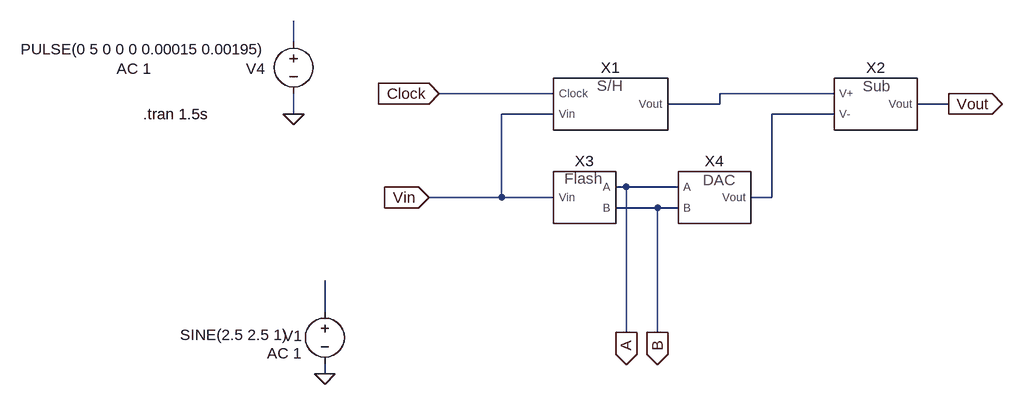
[diagram p0: schematic stage.asc]
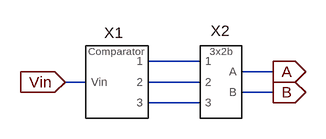
[diagram p1: sub-circuit flash2bits.asc]
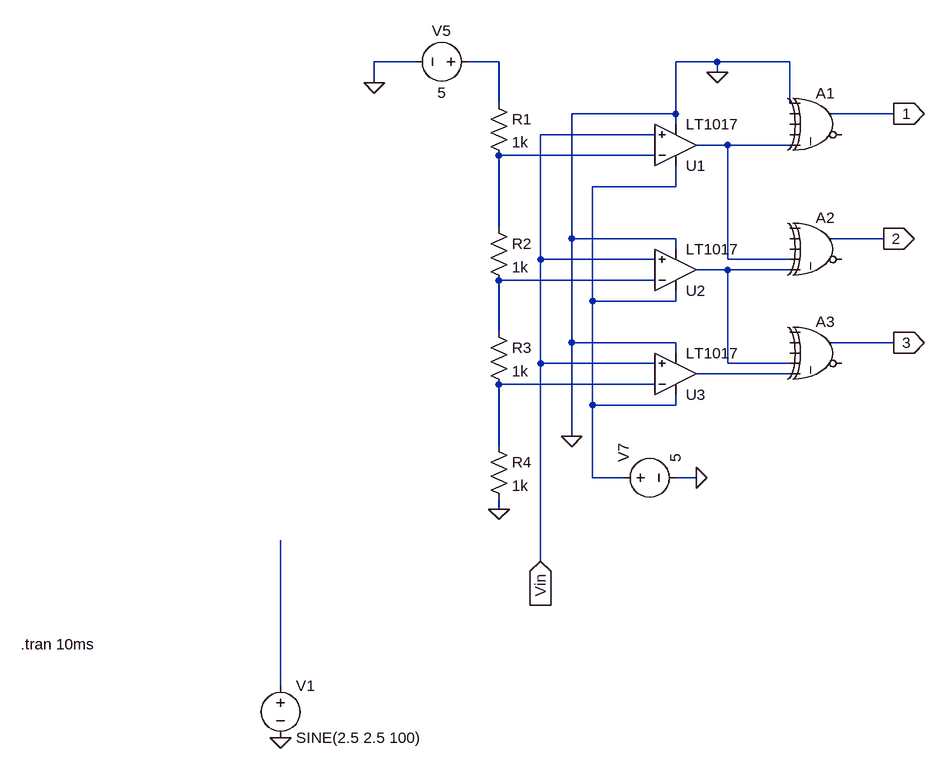
[diagram p2: sub-circuit 4bitscomparator.asc]
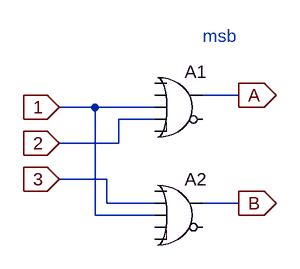
[diagram p3: sub-circuit 3dec2bits.asc]
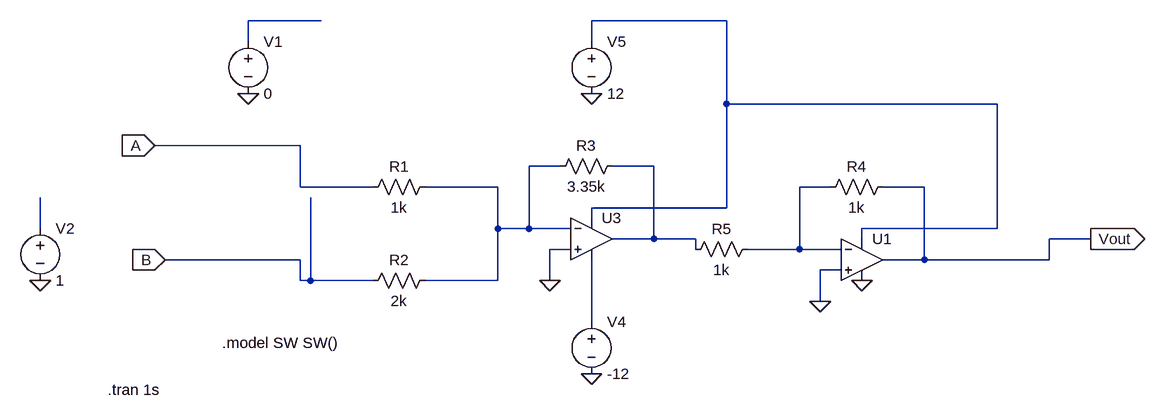
[diagram p4: sub-circuit dac.asc]
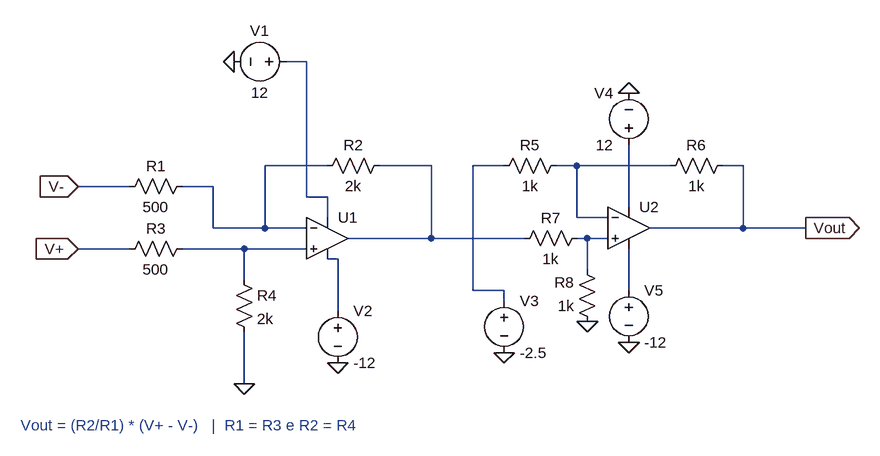
[diagram p5: sub-circuit subtractor.asc]
stage.asc, the LTspice schematic file:
Version 4
SHEET 1 1452 1236
WIRE -240 -80 -240 -112
WIRE 160 0 -16 0
WIRE 592 0 416 0
WIRE 416 16 416 0
WIRE 416 16 336 16
WIRE 768 16 720 16
WIRE -240 32 -240 0
WIRE 160 32 80 32
WIRE 592 32 496 32
WIRE 272 144 256 144
WIRE 352 144 272 144
WIRE 80 160 80 32
WIRE 80 160 -32 160
WIRE 160 160 80 160
WIRE 496 160 496 32
WIRE 496 160 464 160
WIRE 320 176 256 176
WIRE 352 176 320 176
WIRE -192 336 -192 288
WIRE 272 368 272 144
WIRE 320 368 320 176
WIRE -192 432 -192 416
FLAG -240 32 0
FLAG -192 432 0
FLAG 768 16 Vout
IOPIN 768 16 Out
FLAG 272 368 A
IOPIN 272 368 Out
FLAG 320 368 B
IOPIN 320 368 Out
FLAG -16 0 Clock
IOPIN -16 0 In
FLAG -32 160 Vin
IOPIN -32 160 In
SYMBOL voltage -192 320 R0
WINDOW 123 -89 80 Left 2
WINDOW 39 0 0 Left 0
WINDOW 0 -64 53 Left 2
WINDOW 3 -223 52 Left 2
SYMATTR Value2 AC 1
SYMATTR InstName V1
SYMATTR Value SINE(2.5 2.5 1)
SYMBOL voltage -240 -96 R0
WINDOW 123 -219 58 Right 2
WINDOW 39 0 0 Left 0
WINDOW 0 -44 58 Right 2
WINDOW 3 -42 28 Right 2
SYMATTR Value2 AC 1
SYMATTR InstName V4
SYMATTR Value PULSE(0 5 0 0 0 0.00015 0.00195)
SYMBOL SH 240 16 R0
SYMATTR InstName X1
SYMBOL flash2bits 208 160 R0
SYMATTR InstName X3
SYMBOL DAC 400 160 R0
SYMATTR InstName X4
SYMBOL subtractor 656 16 R0
SYMATTR InstName X2
TEXT -472 32 Left 2 !.tran 1.5s

flash2bits.asc, the sub-circuit schematic file:
Version 4
SHEET 1 880 680
WIRE 256 128 176 128
WIRE 368 144 320 144
WIRE 80 160 48 160
WIRE 256 160 176 160
WIRE 368 176 320 176
WIRE 256 192 176 192
FLAG 368 144 A
IOPIN 368 144 Out
FLAG 368 176 B
IOPIN 368 176 Out
FLAG 48 160 Vin
IOPIN 48 160 In
SYMBOL 4bitsComparator 128 160 R0
WINDOW 0 -5 -60 Bottom 2
SYMATTR InstName X1
SYMBOL 3dec2bits 288 160 R0
WINDOW 0 -1 -63 Bottom 2
SYMATTR InstName X2

4bitscomparator.asc, the sub-circuit schematic file:
Version 4
SHEET 1 2344 1640
WIRE 848 256 784 256
WIRE 976 256 928 256
WIRE 1312 256 1248 256
WIRE 1424 256 1312 256
WIRE 1312 272 1312 256
WIRE 784 288 784 256
WIRE 976 320 976 256
WIRE 1424 320 1424 256
WIRE 1248 336 1248 256
WIRE 1248 336 1088 336
WIRE 1584 336 1488 336
WIRE 1248 352 1248 336
WIRE 1216 368 1040 368
WIRE 1328 384 1280 384
WIRE 1424 384 1328 384
WIRE 1216 400 976 400
WIRE 1248 448 1248 416
WIRE 1248 448 1120 448
WIRE 976 512 976 400
WIRE 1088 528 1088 336
WIRE 1248 528 1088 528
WIRE 1568 528 1488 528
WIRE 1248 544 1248 528
WIRE 1040 560 1040 368
WIRE 1216 560 1040 560
WIRE 1328 560 1328 384
WIRE 1424 560 1328 560
WIRE 1328 576 1280 576
WIRE 1424 576 1328 576
WIRE 1216 592 976 592
WIRE 1120 624 1120 448
WIRE 1248 624 1248 608
WIRE 1248 624 1120 624
WIRE 976 672 976 592
WIRE 1088 688 1088 528
WIRE 1248 688 1088 688
WIRE 1584 688 1488 688
WIRE 1248 704 1248 688
WIRE 1040 720 1040 560
WIRE 1216 720 1040 720
WIRE 1328 720 1328 576
WIRE 1424 720 1328 720
WIRE 1424 736 1280 736
WIRE 1216 752 976 752
WIRE 1120 784 1120 624
WIRE 1248 784 1248 768
WIRE 1248 784 1120 784
WIRE 1088 832 1088 688
WIRE 976 848 976 752
WIRE 1120 896 1120 784
WIRE 1168 896 1120 896
WIRE 1280 896 1248 896
WIRE 976 944 976 928
WIRE 1040 1024 1040 720
WIRE 640 1216 640 992
FLAG 1312 272 0
FLAG 1280 896 0
FLAG 1584 688 3
IOPIN 1584 688 Out
FLAG 1568 528 2
IOPIN 1568 528 Out
FLAG 1584 336 1
IOPIN 1584 336 Out
FLAG 784 288 0
FLAG 976 944 0
FLAG 1040 1024 Vin
IOPIN 1040 1024 In
FLAG 640 1296 0
FLAG 1088 832 0
SYMBOL res 960 304 R0
SYMATTR InstName R1
SYMATTR Value 1k
SYMBOL voltage 944 256 R90
WINDOW 0 -32 56 VBottom 2
WINDOW 3 32 56 VTop 2
WINDOW 123 0 0 Left 0
WINDOW 39 0 0 Left 0
SYMATTR InstName V5
SYMATTR Value 5
SYMBOL res 960 496 R0
SYMATTR InstName R2
SYMATTR Value 1k
SYMBOL res 960 656 R0
SYMATTR InstName R3
SYMATTR Value 1k
SYMBOL voltage 1152 896 R270
WINDOW 123 0 0 Left 0
WINDOW 39 0 0 Left 0
SYMATTR InstName V7
SYMATTR Value 5
SYMBOL res 960 832 R0
SYMATTR InstName R4
SYMATTR Value 1k
SYMBOL Digital\\xor 1472 288 R0
SYMATTR InstName A1
SYMBOL Digital\\xor 1472 480 R0
SYMATTR InstName A2
SYMBOL Digital\\xor 1472 640 R0
SYMATTR InstName A3
SYMBOL voltage 640 1200 R0
WINDOW 123 0 0 Left 0
WINDOW 39 0 0 Left 0
SYMATTR InstName V1
SYMATTR Value SINE(2.5 2.5 100)
SYMBOL Comparators\\LT1017 1248 384 M180
SYMATTR InstName U1
SYMBOL Comparators\\LT1017 1248 576 M180
SYMATTR InstName U2
SYMBOL Comparators\\LT1017 1248 736 M180
SYMATTR InstName U3
TEXT 240 1152 Left 2 !.tran 10ms

3dec2bits.asc, the sub-circuit schematic file:
Version 4
SHEET 1 880 680
WIRE 352 32 304 32
WIRE 160 48 112 48
WIRE 240 48 160 48
WIRE 240 64 192 64
WIRE 192 96 192 64
WIRE 192 96 112 96
WIRE 176 144 112 144
WIRE 176 176 176 144
WIRE 240 176 176 176
WIRE 352 176 304 176
WIRE 160 192 160 48
WIRE 240 192 160 192
FLAG 352 32 A
IOPIN 352 32 Out
FLAG 352 176 B
IOPIN 352 176 Out
FLAG 112 48 1
IOPIN 112 48 In
FLAG 112 96 2
IOPIN 112 96 In
FLAG 112 144 3
IOPIN 112 144 In
SYMBOL Digital\\or 272 -16 R0
SYMATTR InstName A1
SYMBOL Digital\\or 272 128 R0
SYMATTR InstName A2
TEXT 304 -48 Left 2 ;msb

dac.asc, the sub-circuit schematic file:
Version 4
SHEET 1 1184 680
WIRE -112 -160 -224 -160
WIRE 512 -160 304 -160
WIRE -224 -128 -224 -160
WIRE 304 -128 304 -160
WIRE 512 -32 512 -160
WIRE 928 -32 512 -32
WIRE -144 32 -368 32
WIRE 256 64 208 64
WIRE 400 64 336 64
WIRE -144 96 -144 32
WIRE -32 96 -144 96
WIRE 160 96 48 96
WIRE 672 96 624 96
WIRE 816 96 752 96
WIRE 512 128 512 -32
WIRE 512 128 304 128
WIRE 304 144 304 128
WIRE -544 160 -544 112
WIRE 160 160 160 96
WIRE 208 160 208 64
WIRE 208 160 160 160
WIRE 272 160 208 160
WIRE 928 160 928 -32
WIRE 928 160 720 160
WIRE 400 176 400 64
WIRE 400 176 336 176
WIRE 464 176 400 176
WIRE 720 176 720 160
WIRE 1072 176 1008 176
WIRE 272 192 240 192
WIRE 464 192 464 176
WIRE 624 192 624 96
WIRE 624 192 544 192
WIRE 688 192 624 192
WIRE -144 208 -352 208
WIRE 816 208 816 96
WIRE 816 208 752 208
WIRE 1008 208 1008 176
WIRE 1008 208 816 208
WIRE 688 224 656 224
WIRE -144 240 -144 208
WIRE -128 240 -128 112
WIRE -128 240 -144 240
WIRE -32 240 -128 240
WIRE 160 240 160 160
WIRE 160 240 48 240
WIRE 240 240 240 192
WIRE 656 272 656 224
WIRE 304 304 304 208
FLAG 240 240 0
FLAG 1072 176 Vout
IOPIN 1072 176 Out
FLAG -368 32 A
IOPIN -368 32 In
FLAG -352 208 B
IOPIN -352 208 In
FLAG 304 -48 0
FLAG 656 272 0
FLAG 720 240 0
FLAG 304 384 0
FLAG -224 -48 0
FLAG -544 240 0
SYMBOL res 64 80 R90
WINDOW 0 0 56 VBottom 2
WINDOW 3 32 56 VTop 2
SYMATTR InstName R1
SYMATTR Value 1k
SYMBOL res 64 224 R90
WINDOW 0 0 56 VBottom 2
WINDOW 3 32 56 VTop 2
SYMATTR InstName R2
SYMATTR Value 2k
SYMBOL res 352 48 R90
WINDOW 0 0 56 VBottom 2
WINDOW 3 32 56 VTop 2
SYMATTR InstName R3
SYMATTR Value 3.35k
SYMBOL voltage 304 -144 R0
WINDOW 123 0 0 Left 0
WINDOW 39 0 0 Left 0
SYMATTR InstName V5
SYMATTR Value 12
SYMBOL Opamps\\UniversalOpamp2 304 176 R0
SYMATTR InstName U3
SYMBOL res 768 80 R90
WINDOW 0 0 56 VBottom 2
WINDOW 3 32 56 VTop 2
SYMATTR InstName R4
SYMATTR Value 1k
SYMBOL Opamps\\UniversalOpamp2 720 208 R0
SYMATTR InstName U1
SYMBOL res 560 176 R90
WINDOW 0 0 56 VBottom 2
WINDOW 3 32 56 VTop 2
SYMATTR InstName R5
SYMATTR Value 1k
SYMBOL voltage 304 288 R0
WINDOW 123 0 0 Left 0
WINDOW 39 0 0 Left 0
SYMATTR InstName V4
SYMATTR Value -12
SYMBOL voltage -224 -144 R0
WINDOW 123 0 0 Left 0
WINDOW 39 0 0 Left 0
SYMATTR InstName V1
SYMATTR Value 0
SYMBOL voltage -544 144 R0
WINDOW 123 0 0 Left 0
WINDOW 39 0 0 Left 0
SYMATTR InstName V2
SYMATTR Value 1
TEXT -264 336 Left 2 !.model SW SW()
TEXT -440 408 Left 2 !.tran 1s

subtractor.asc, the sub-circuit schematic file:
Version 4
SHEET 1 1344 680
WIRE 144 -128 112 -128
WIRE 176 32 80 32
WIRE 336 32 256 32
WIRE 448 32 400 32
WIRE 560 32 528 32
WIRE 704 32 560 32
WIRE 816 32 784 32
WIRE -128 64 -208 64
WIRE 0 64 -48 64
WIRE 144 80 144 -128
WIRE 176 80 144 80
WIRE 640 96 640 0
WIRE 176 112 176 80
WIRE 560 112 560 32
WIRE 608 112 560 112
WIRE 0 128 0 64
WIRE 80 128 80 32
WIRE 80 128 0 128
WIRE 144 128 80 128
WIRE 816 128 816 32
WIRE 816 128 672 128
WIRE 912 128 816 128
WIRE 336 144 336 32
WIRE 336 144 208 144
WIRE 480 144 336 144
WIRE 576 144 560 144
WIRE 608 144 576 144
WIRE -128 160 -208 160
WIRE 48 160 -48 160
WIRE 144 160 48 160
WIRE 192 176 176 176
WIRE 576 192 576 144
WIRE 48 208 48 160
WIRE 400 224 400 32
WIRE 448 224 400 224
WIRE 640 224 640 160
WIRE 448 240 448 224
WIRE 192 256 192 176
WIRE 48 368 48 288
FLAG 912 128 Vout
IOPIN 912 128 Out
FLAG -208 64 V-
IOPIN -208 64 In
FLAG -208 160 V+
IOPIN -208 160 In
FLAG 48 368 0
FLAG 32 -128 0
FLAG 192 336 0
FLAG 640 304 0
FLAG 640 -80 0
FLAG 448 320 0
FLAG 576 272 0
SYMBOL res 32 192 R0
SYMATTR InstName R4
SYMATTR Value 2k
SYMBOL res -32 144 R90
WINDOW 0 0 56 VBottom 2
WINDOW 3 32 56 VTop 2
SYMATTR InstName R3
SYMATTR Value 500
SYMBOL res -32 48 R90
WINDOW 0 0 56 VBottom 2
WINDOW 3 32 56 VTop 2
SYMATTR InstName R1
SYMATTR Value 500
SYMBOL res 272 16 R90
WINDOW 0 0 56 VBottom 2
WINDOW 3 32 56 VTop 2
SYMATTR InstName R2
SYMATTR Value 2k
SYMBOL voltage 128 -128 R90
WINDOW 0 -32 56 VBottom 2
WINDOW 3 32 56 VTop 2
WINDOW 123 0 0 Left 0
WINDOW 39 0 0 Left 0
SYMATTR InstName V1
SYMATTR Value 12
SYMBOL Opamps\\UniversalOpamp2 176 144 R0
SYMATTR InstName U1
SYMBOL voltage 192 240 R0
WINDOW 123 0 0 Left 0
WINDOW 39 0 0 Left 0
SYMATTR InstName V2
SYMATTR Value -12
SYMBOL Opamps\\UniversalOpamp2 640 128 R0
SYMATTR InstName U2
SYMBOL res 544 16 R90
WINDOW 0 0 56 VBottom 2
WINDOW 3 32 56 VTop 2
SYMATTR InstName R5
SYMATTR Value 1k
SYMBOL voltage 640 16 R180
WINDOW 0 24 96 Left 2
WINDOW 3 24 16 Left 2
WINDOW 123 0 0 Left 0
WINDOW 39 0 0 Left 0
SYMATTR InstName V4
SYMATTR Value 12
SYMBOL voltage 640 208 R0
WINDOW 123 0 0 Left 0
WINDOW 39 0 0 Left 0
SYMATTR InstName V5
SYMATTR Value -12
SYMBOL res 800 16 R90
WINDOW 0 0 56 VBottom 2
WINDOW 3 32 56 VTop 2
SYMATTR InstName R6
SYMATTR Value 1k
SYMBOL res 576 128 R90
WINDOW 0 0 56 VBottom 2
WINDOW 3 32 56 VTop 2
SYMATTR InstName R7
SYMATTR Value 1k
SYMBOL voltage 448 224 R0
WINDOW 123 0 0 Left 0
WINDOW 39 0 0 Left 0
SYMATTR InstName V3
SYMATTR Value -2.5
SYMBOL res 592 288 R180
WINDOW 0 36 76 Left 2
WINDOW 3 36 40 Left 2
SYMATTR InstName R8
SYMATTR Value 1k
TEXT -296 432 Left 2 ;Vout = (R2/R1) * (V+ - V-)   |  R1 = R3 e R2 = R4

The netlist it stands for:
* stage.asc
V1 N004 0 SINE(2.5 2.5 1) AC 1
V4 N001 0 PULSE(0 5 0 0 0 0.00015 0.00195) AC 1
XX1 Clock Vin N002 SH  ; pins Clock Vin Vout
XX3 Vin A B flash2bits
XX4 A B N003 dac
XX2 N002 N003 Vout subtractor

* block symbol definitions
.subckt flash2bits Vin A B
XX1 Vin N001 N002 N003 4bitscomparator
XX2 N001 N002 N003 A B 3dec2bits
.ends flash2bits

.subckt 4bitscomparator Vin 1 2 3
R1 N001 N003 1k
V5 N001 0 5
R2 N003 N006 1k
R3 N006 N008 1k
V7 N004 0 5
R4 N008 0 1k
A1 0 0 0 0 N002 0 1 0 XOR
A2 0 0 0 N002 N005 0 2 0 XOR
A3 0 0 0 N005 N007 0 3 0 XOR
V1 N009 0 SINE(2.5 2.5 100)
XU1 Vin N003 N004 0 N002 LT1017  ; pins In+ In- V+ V- OUT
XU2 Vin N006 N004 0 N005 LT1017  ; pins In+ In- V+ V- OUT
XU3 Vin N008 N004 0 N007 LT1017  ; pins In+ In- V+ V- OUT
.tran 10ms
.ends 4bitscomparator

.subckt 3dec2bits 1 2 3 A B
A1 0 0 1 2 0 0 A 0 OR
A2 0 3 1 0 0 0 B 0 OR
* msb
.ends 3dec2bits

.subckt dac A B Vout
R1 N003 A 1k
R2 N003 B 2k
R3 N004 N003 3.35k
V5 N002 0 12
XU3 0 N003 N002 N007 N004 level.2 Avol=1Meg GBW=10Meg Slew=10Meg ilimit=25m rail=0 Vos=0 phimargin=45 en=0 enk=0 in=0 ink=0 Rin=500Meg  ; pins IN+ IN- V+ V- OUT
R4 Vout N005 1k
XU1 0 N005 N002 0 Vout level.2 Avol=1Meg GBW=10Meg Slew=10Meg ilimit=25m rail=0 Vos=0 phimargin=45 en=0 enk=0 in=0 ink=0 Rin=500Meg  ; pins IN+ IN- V+ V- OUT
R5 N005 N004 1k
V4 N007 0 -12
V1 N001 0 0
V2 N006 0 1
.model SW SW()
.tran 1s
.ends dac

.subckt subtractor V+ V- Vout
R4 N008 0 2k
R3 N008 V+ 500
R1 N002 V- 500
R2 N003 N002 2k
V1 N001 0 12
XU1 N008 N002 N001 N009 N003 level.2 Avol=1Meg GBW=10Meg Slew=10Meg ilimit=25m rail=0 Vos=0 phimargin=45 en=0 enk=0 in=0 ink=0 Rin=500Meg  ; pins IN+ IN- V+ V- OUT
V2 N009 0 -12
XU2 N007 N005 N006 N010 Vout level.2 Avol=1Meg GBW=10Meg Slew=10Meg ilimit=25m rail=0 Vos=0 phimargin=45 en=0 enk=0 in=0 ink=0 Rin=500Meg  ; pins IN+ IN- V+ V- OUT
R5 N005 N004 1k
V4 N006 0 12
V5 N010 0 -12
R6 Vout N005 1k
R7 N007 N003 1k
V3 N004 0 -2.5
R8 0 N007 1k
* Vout = (R2/R1) * (V+ - V-)   |  R1 = R3 e R2 = R4
.ends subtractor

.tran 1.5s
.lib UniversalOpamps2.sub
.backanno
.end